# EAGLE design Placa motriz (EAGLE 9.1.3)
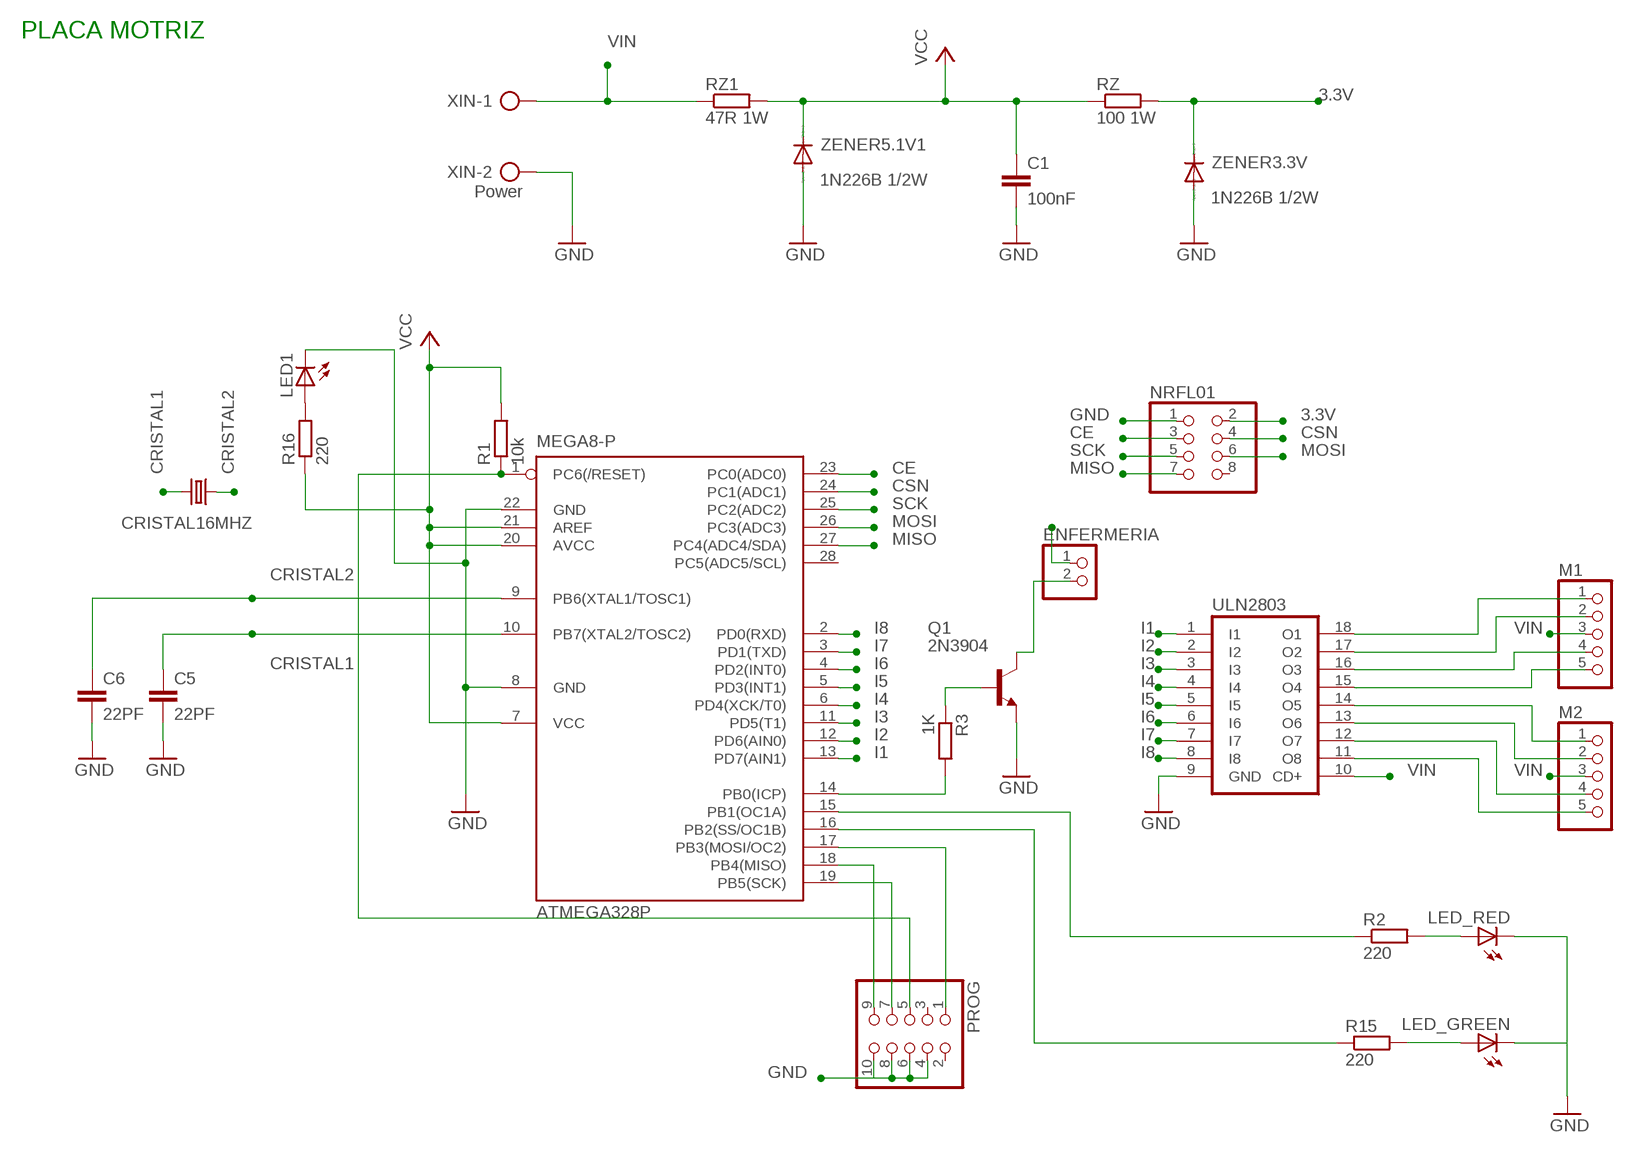
[diagram p0: schematic, sheet 1]

## Parts
ATMEGA328P  MEGA8-P  [DIL28-3]
C1  100nF  C-EU050-024X044  [C050-024X044]
C5  22PF  C-EU050-024X044  [C050-024X044]
C6  22PF  C-EU050-024X044  [C050-024X044]
CRISTAL16MHZ  CRYSTALHC49S  [HC49/S]
ENFERMERIA  PINHD-1X2  [1X02]
LED1  LED5MM  [LED5MM]
LED_GREEN  LED5MM  [LED5MM]
LED_RED  LED5MM  [LED5MM]
M1  PINHD-1X5  [1X05]
M2  PINHD-1X5  [1X05]
NRFL01  PINHD-2X4  [2X04]
PROG  PINHD-2X5  [2X05]
Q1  2N3904  [TO92]
R1  10k  R-EU_0207/15  [0207/15]
R2  220  R-EU_0207/12  [0207/12]
R3  1K  R-EU_0207/10  [0207/10]
R15  220  R-EU_0207/12  [0207/12]
R16  220  R-EU_0207/12  [0207/12]
RZ  100 1W  R-EU_0207/15  [0207/15]
RZ1  47R 1W  R-EU_0207/15  [0207/15]
ULN2803  ULN2803A  [DIL18]
XIN  Power  AK500/2  [AK500/2]
ZENER3.3V  1N226B 1/2W  1N4148DO35-10  [DO35-10]
ZENER5.1V1  1N226B 1/2W  1N4148DO35-10  [DO35-10]

## Nets
3.3V: NRFL01.2 RZ.2 ZENER3.3V.C
CE: ATMEGA328P.23(PC0(ADC0)) NRFL01.3
CRISTAL1: ATMEGA328P.10(PB7(XTAL2/TOSC2)) C5.1 CRISTAL16MHZ.2
CRISTAL2: ATMEGA328P.9(PB6(XTAL1/TOSC1)) C6.1 CRISTAL16MHZ.1
CSN: ATMEGA328P.24(PC1(ADC1)) NRFL01.4
GND: ATMEGA328P.8(GND) ATMEGA328P.22(GND) C1.2 C5.2 C6.2 LED1.K(C) LED_GREEN.K(C) LED_RED.K(C) NRFL01.1 PROG.4 PROG.6 PROG.8 PROG.10 Q1.3(E) ULN2803.9(GND) XIN.2 ZENER3.3V.A ZENER5.1V1.A
I1: ATMEGA328P.13(PD7(AIN1)) ULN2803.1(I1)
I2: ATMEGA328P.12(PD6(AIN0)) ULN2803.2(I2)
I3: ATMEGA328P.11(PD5(T1)) ULN2803.3(I3)
I4: ATMEGA328P.6(PD4(XCK/T0)) ULN2803.4(I4)
I5: ATMEGA328P.5(PD3(INT1)) ULN2803.5(I5)
I6: ATMEGA328P.4(PD2(INT0)) ULN2803.6(I6)
I7: ATMEGA328P.3(PD1(TXD)) ULN2803.7(I7)
I8: ATMEGA328P.2(PD0(RXD)) ULN2803.8(I8)
MISO: ATMEGA328P.27(PC4(ADC4/SDA)) NRFL01.7
MOSI: ATMEGA328P.26(PC3(ADC3)) NRFL01.6
N$1: ATMEGA328P.1(PC6(/RESET)) PROG.5 R1.1
N$2: LED_RED.A R2.2
N$11: M1.1 ULN2803.18(O1)
N$12: M1.2 ULN2803.17(O2)
N$13: M1.4 ULN2803.16(O3)
N$14: M1.5 ULN2803.15(O4)
N$15: M2.1 ULN2803.14(O5)
N$16: ATMEGA328P.17(PB3(MOSI/OC2)) PROG.1
N$17: LED1.A R16.2
N$18: ATMEGA328P.19(PB5(SCK)) PROG.7
N$19: ATMEGA328P.18(PB4(MISO)) PROG.9
N$20: M2.2 ULN2803.13(O6)
N$21: M2.4 ULN2803.12(O7)
N$22: M2.5 ULN2803.11(O8)
N$23: ATMEGA328P.15(PB1(OC1A)) R2.1
N$24: ATMEGA328P.16(PB2(SS/OC1B)) R15.1
N$48: ATMEGA328P.14(PB0(ICP)) R3.2
N$49: Q1.2(B) R3.1
N$50: ENFERMERIA.2 Q1.1(C)
N$153: LED_GREEN.A R15.2
SCK: ATMEGA328P.25(PC2(ADC2)) NRFL01.5
VCC: ATMEGA328P.7(VCC) ATMEGA328P.20(AVCC) ATMEGA328P.21(AREF) C1.1 R1.2 R16.1 RZ1.2 RZ.1 ZENER5.1V1.C
VIN: ENFERMERIA.1 M1.3 M2.3 RZ1.1 ULN2803.10(CD+) XIN.1
Unconnected: ATMEGA328P.28(PC5(ADC5/SCL)) NRFL01.8 PROG.2 PROG.3

## Notes on the sheet
- PLACA MOTRIZ

## Library data of the parts
ATMEGA328P = atmel:MEGA8-P: MICROCONTROLLER 8 Kbytes FLASH, 1 kbytes SRAM, 512 bytes EEPROM, USART, 4-channel 10 bit ADC, 2-channel 8 bit ADC Pin compatible with Atmega48, ATMega88, ATMega168 Source: avr.lbr; OC_FARNELL: unknown; OC_NEWARK: unknown
C1 C5 C6 = rcl:C-EU: CAPACITOR, European symbol
CRISTAL16MHZ = crystal:CRYSTAL: CRYSTAL; OC_FARNELL: 1667008; OC_NEWARK: unknown
ENFERMERIA = pinhead:PINHD-1X2: PIN HEADER
LED1 LED_GREEN LED_RED = led:LED: LED OSRAM: - CHIPLED LG R971, LG N971, LY N971, LG Q971, LY Q971, LO R971, LY R971 LH N974, LH R974 LS Q976, LO Q976, LY Q976 LO Q996 - Hyper CHIPLED LW Q18S LB Q993, LB Q99A, LB R99A - SideLED LS A670, LO A670, LY A670, LG A670, LP A670 LB A673, LV A673, LT A673, LW A673 LH A674 LY A675 LS A676, LA A676, LO A676, LY A676, LW A676 LS A679, LY A679, LG A679 - Hyper Micro SIDELED® LS Y876, LA Y876, LO Y876, LY Y876 LT Y87S - SmartLED LW L88C, LW L88S LB L89C, LB L89S, LG L890 LS L89K, LO L89K, LY L89K LS L896, LA L896, LO L896, LY L896 - TOPLED LS T670, LO T670, LY T670, LG T670, LP T670 LSG T670, LSP T670, LSY T670, LOP T670, LYG T670 LG T671, LOG T671, LSG T671 LB T673, LV T673, LT T673, LW T673 LH T674 LS T676, LA T676, LO T676, LY T676, LB T676, LH T676, LSB T676, LW T676 LB T67C, LV T67C, LT T67C, LS T67K, LO T67K, LY T67K, LW E67C LS E67B, LA E67B, LO E67B, LY E67B, LB E67C, LV E67C, LT E67C LW T67C LS T679, LY T679, LG T679 LS T770, LO T770, LY T770, LG T770, LP T770 LB T773, LV T773, LT T773, LW T773 LH T774 LS E675, LA E675, LY E675, LS T675 LS T776, LA T776, LO T776, LY T776, LB T776 LHGB T686 LT T68C, LB T68C - Hyper Mini TOPLED® LB M676 - Mini TOPLED Santana® LG M470 LS M47K, LO M47K, LY M47K Source: http://www.osram.convergy.de LUXEON: - LUMILED® LXK2-PW12-R00, LXK2-PW12-S00, LXK2-PW14-U00, LXK2-PW14-V00 LXK2-PM12-R00, LXK2-PM12-S00, LXK2-PM14-U00 LXK2-PE12-Q00, LXK2-PE12-R00, LXK2-PE12-S00, LXK2-PE14-T00, LXK2-PE14-U00 LXK2-PB12-K00, LXK2-PB12-L00, LXK2-PB12-M00, LXK2-PB14-N00, LXK2-PB14-P00, LXK2-PB14-Q00 LXK2-PR12-L00, LXK2-PR12-M00, LXK2-PR14-Q00, LXK2-PR14-R00 LXK2-PD12-Q00, LXK2-PD12-R00, LXK2-PD12-S00 LXK2-PH12-R00, LXK2-PH12-S00 LXK2-PL12-P00, LXK2-PL12-Q00, LXK2-PL12-R00 Source: www.luxeon.com KINGBRIGHT: KA-3528ASYC Source: www.kingbright.com
M1 M2 = pinhead:PINHD-1X5: PIN HEADER
NRFL01 = pinhead:PINHD-2X4: PIN HEADER
PROG = pinhead:PINHD-2X5: PIN HEADER
Q1 = transistor-npn:2N3904: NPN Transistor
R1-R3 R15 R16 RZ RZ1 = rcl:R-EU_: RESISTOR, European symbol
ULN2803 = uln-udn:ULN2803A: DRIVER ARRAY
XIN = con-ptr500:AK500/2: CONNECTOR; OC_FARNELL: unknown; OC_NEWARK: unknown
ZENER3.3V ZENER5.1V1 = diode:1N4148: DIODE high speed (Philips)

## Board
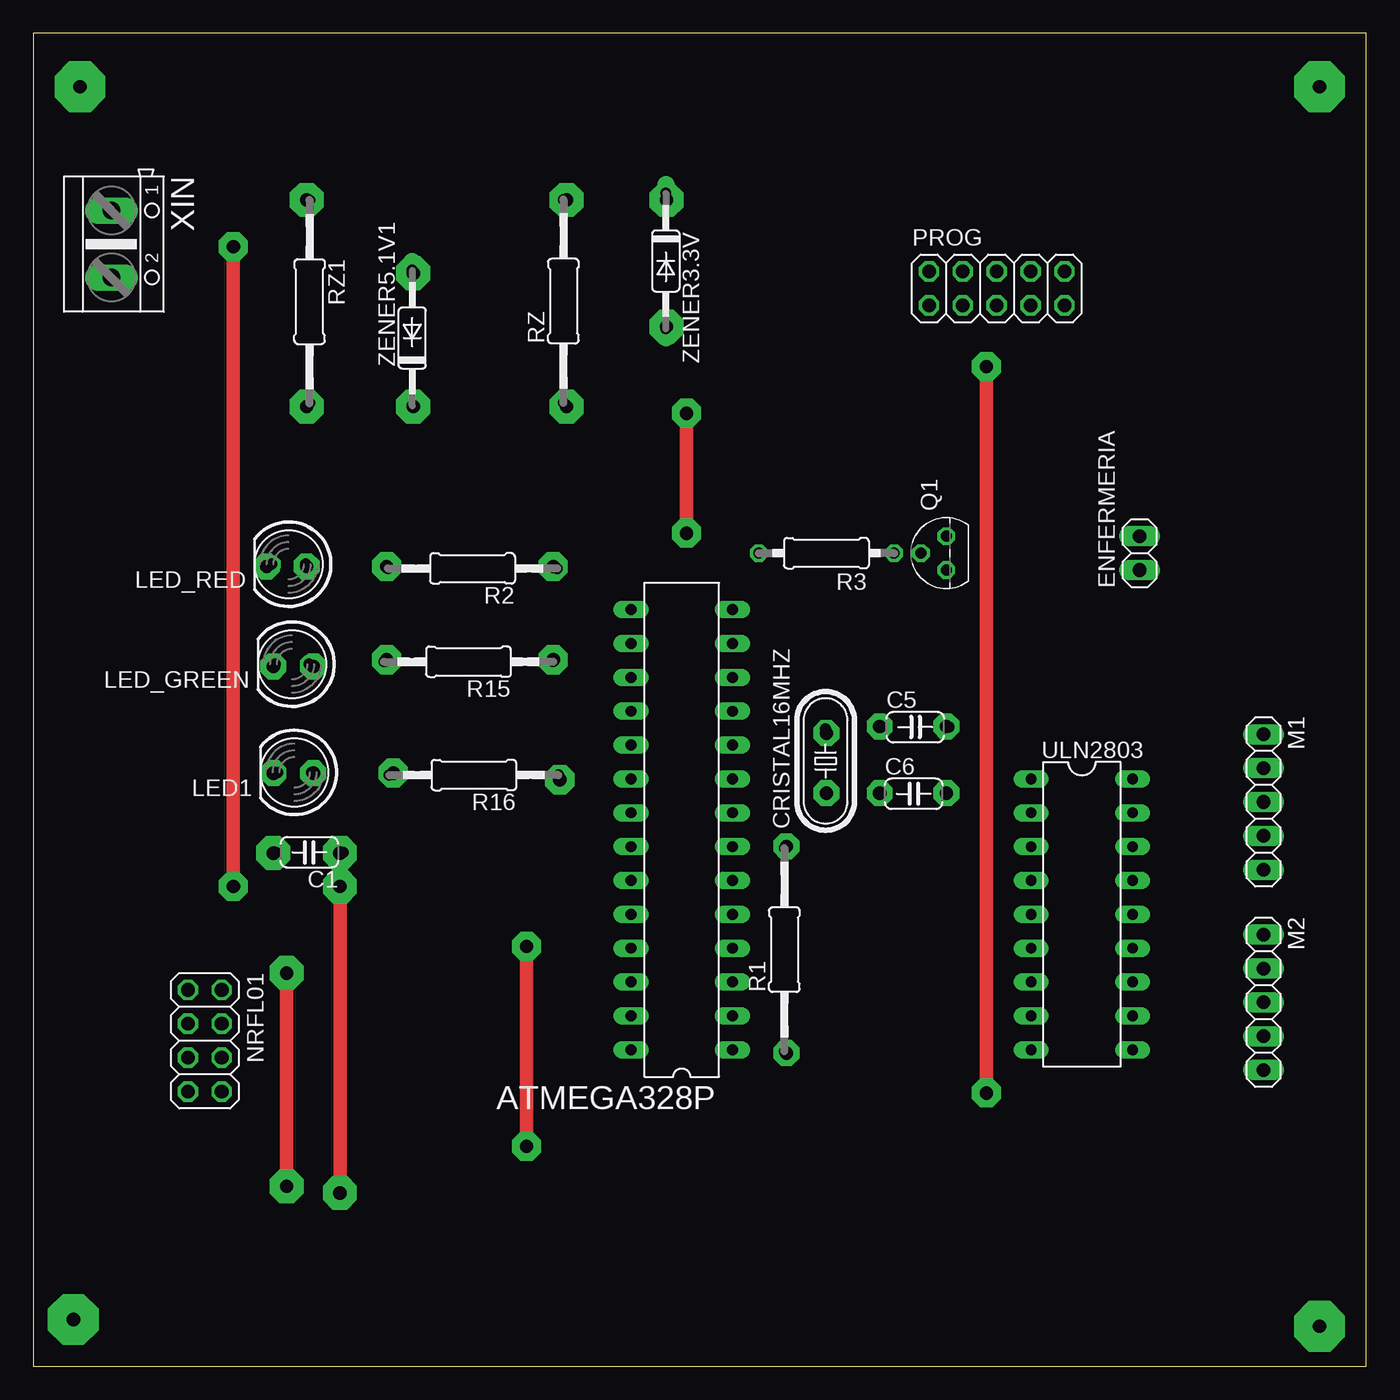
[diagram p1: board, top side]
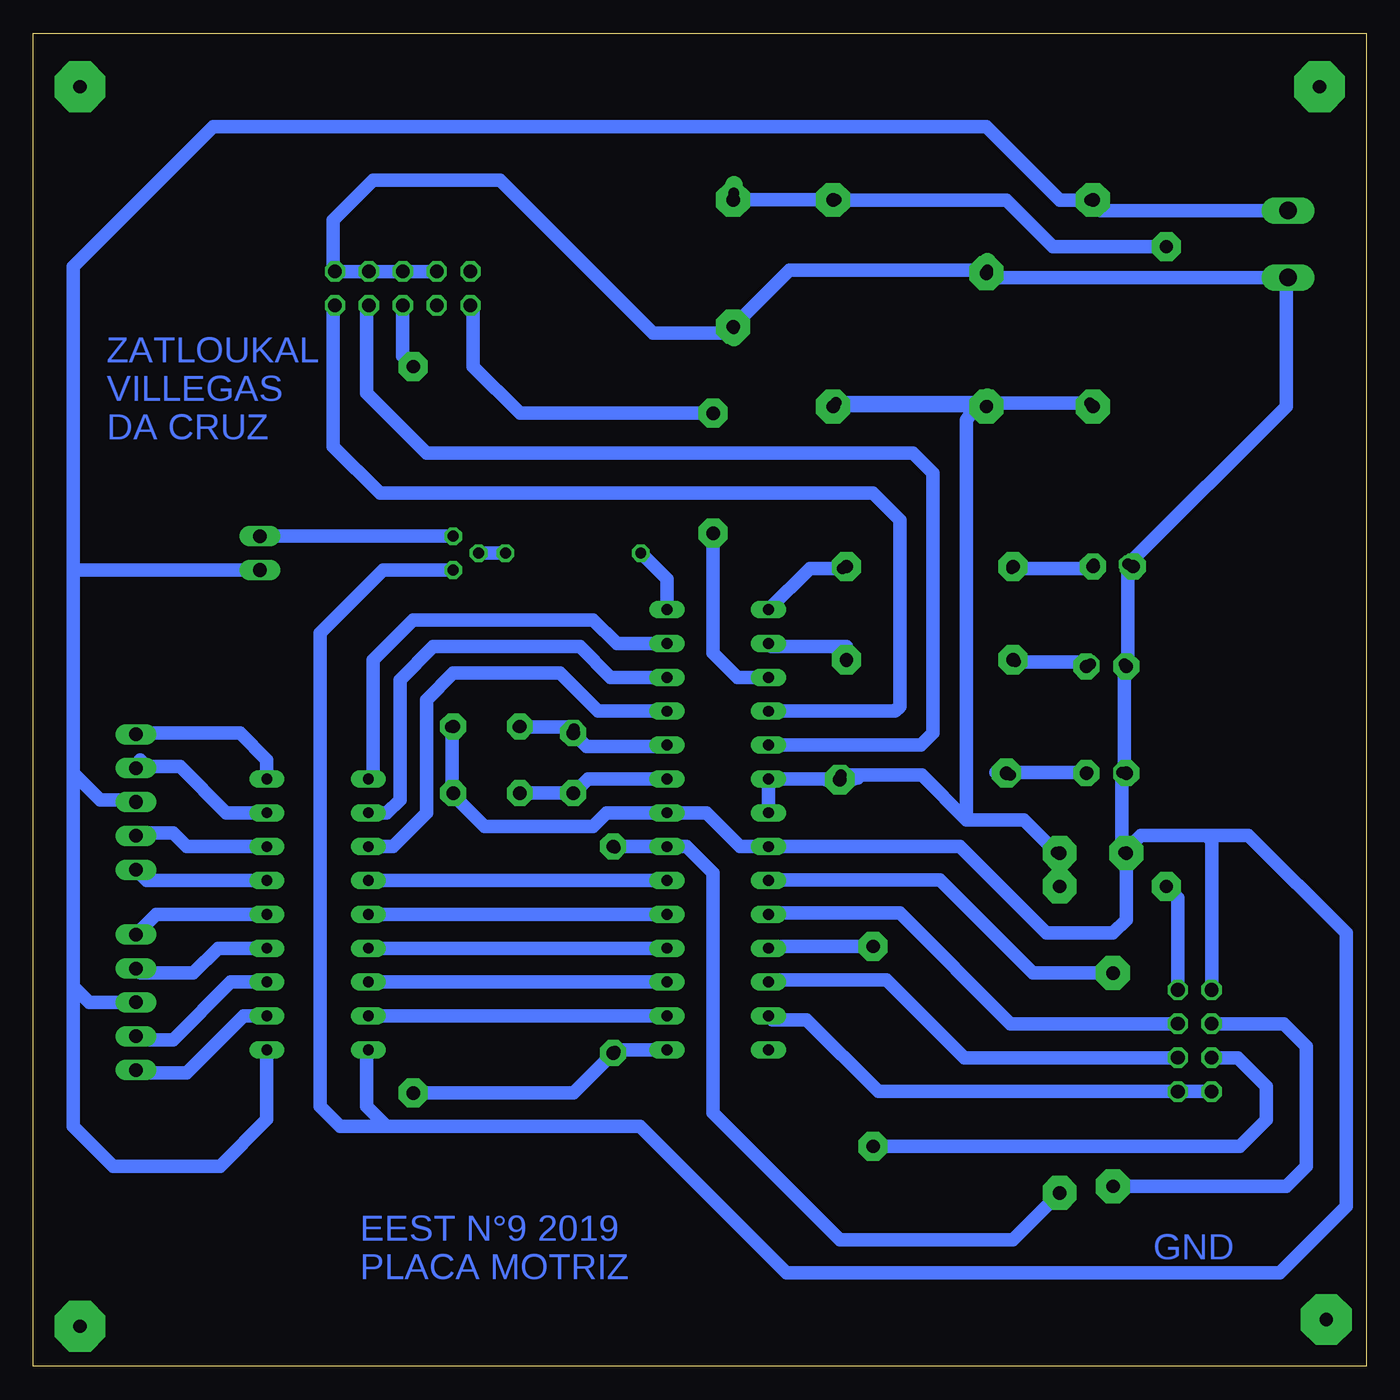
[diagram p2: board, bottom side, seen from below]

Size 100 x 100 mm. Coordinates in mm from the lower left corner, seen from the top.
Outline: 0,0 100,0 100,100 0,100 0,0
Copper layers (1*16): Top 0.035mm / dielectric 1.5mm / Bottom 0.035mm
Design rules "default": minimum track width 10mil, minimum drill 24mil, track to track 8mil, track to pad 8mil, pad to pad 8mil, via to via 8mil, smd to smd 8mil, copper to edge 40mil, drill to drill 8mil, minimum pad ring 10mil, minimum via ring 8mil, stop-mask expansion 4mil, vias tented up to drill 0mil, thermal gap 10mil

### Footprints (pad centres in the part's own frame; a part is rotated, then mirrored left to right if it is on the bottom)
DIL28-3 = drill 0.813 long: 1 -16.51,-3.81; 2 -13.97,-3.81; 3 -11.43,-3.81; 4 -8.89,-3.81; 5 -6.35,-3.81; 6 -3.81,-3.81; 7 -1.27,-3.81; 8 1.27,-3.81; 9 3.81,-3.81; 10 6.35,-3.81; 11 8.89,-3.81; 12 11.43,-3.81; 13 13.97,-3.81; 14 16.51,-3.81; 15 16.51,3.81; 16 13.97,3.81; 17 11.43,3.81; 18 8.89,3.81; 19 6.35,3.81; 20 3.81,3.81; 21 1.27,3.81; 22 -1.27,3.81; 23 -3.81,3.81; 24 -6.35,3.81; 25 -8.89,3.81; 26 -11.43,3.81; 27 -13.97,3.81; 28 -16.51,3.81
C050-024X044 = drill 0.813 octagon: 1 -2.54,0; 2 2.54,0
HC49/S = drill 0.813: 1 -2.413,0; 2 2.413,0
1X02 = drill 1.016 long: 1 -1.27,0; 2 1.27,0
LED5MM = drill 0.813 octagon: A -1.27,0; K 1.27,0
1X05 = drill 1.016 long: 1 -5.08,0; 2 -2.54,0; 3 0,0; 4 2.54,0; 5 5.08,0
2X04 = drill 1.016 octagon: 1 -3.81,-1.27; 2 -3.81,1.27; 3 -1.27,-1.27; 4 -1.27,1.27; 5 1.27,-1.27; 6 1.27,1.27; 7 3.81,-1.27; 8 3.81,1.27
2X05 = drill 1.016 octagon: 1 -5.08,-1.27; 2 -5.08,1.27; 3 -2.54,-1.27; 4 -2.54,1.27; 5 0,-1.27; 6 0,1.27; 7 2.54,-1.27; 8 2.54,1.27; 9 5.08,-1.27; 10 5.08,1.27
TO92 = drill 0.813 octagon: 1 1.27,0; 2 0,1.905; 3 -1.27,0
0207/15 = drill 0.813 octagon: 1 -7.62,0; 2 7.62,0
0207/12 = drill 0.813 octagon: 1 -6.35,0; 2 6.35,0
0207/10 = drill 0.813 octagon: 1 -5.08,0; 2 5.08,0
DIL18 = drill 0.813 long: 1 -10.16,-3.81; 2 -7.62,-3.81; 3 -5.08,-3.81; 4 -2.54,-3.81; 5 0,-3.81; 6 2.54,-3.81; 7 5.08,-3.81; 8 7.62,-3.81; 9 10.16,-3.81; 10 10.16,3.81; 11 7.62,3.81; 12 5.08,3.81; 13 2.54,3.81; 14 0,3.81; 15 -2.54,3.81; 16 -5.08,3.81; 17 -7.62,3.81; 18 -10.16,3.81
AK500/2 = drill 1.321 long: 1 -2.515,0; 2 2.515,0
DO35-10 = drill 0.813 long: A 5.08,0; C -5.08,0

### Placement (x,y rotation side)
ATMEGA328P  48.65,40.25 90 top
C1  20.71,38.55 180 top
C5  66.17,47.95 0 top
C6  66.05,42.95 0 top
CRISTAL16MHZ  59.44,45.41 90 top
ENFERMERIA  83,61 90 top
LED1  19.59,44.55 180 top
LED_GREEN  19.41,52.67 180 top
LED_RED  19.15,60.17 180 top
M1  92.3,42.33 270 top
M2  92.3,27.3 270 top
NRFL01  12.86,24.42 270 top
PROG  72.28,80.86 0 top
Q1  68.5,61 90 top
R1  56.35,31.25 90 top
R2  32.95,59.85 180 top
R3  59.5,61 180 top
R15  32.65,52.85 180 top
R16  33.05,44.35 180 top
RZ  39.77,79.91 90 top
RZ1  20.73,79.87 270 top
ULN2803  78.67,33.9 270 top
XIN  5.85,84.19 270 top
ZENER3.3V  47.45,82.92 270 top
ZENER5.1V1  28.43,77.14 90 top

### Tracks (layer width: path | path; a pad name or v marks a point on that pad's centre or on a via)
3.3V  (via drill 1 pad 2.18)
  Top 1.016: v15,36 v15,84
  Bottom 1.016: ZENER3.3V.C 46.98,87.53 RZ.2 39.74,87.5 27,87.5 23.5,84 v15,84 | NRFL01.2 14.13,35.13 v15,36
CE  (via drill 1 pad 2.54)
  Top 1.016: v19,13.5 v19,29.5
  Bottom 1.016: NRFL01.3 6.19,25.69 4.5,24 4.5,15 6,13.5 v19,13.5 | v19,29.5 25,29.5 32,36.5 44.78,36.5 ATMEGA328P.23
CRISTAL1
  Bottom 1.016: C5.1 59.57,47.95 CRISTAL16MHZ.2 59.44,47.44 58.5,46.5 52.56,46.5 ATMEGA328P.10
CRISTAL2
  Bottom 1.016: ATMEGA328P.9 58.38,44.06 CRISTAL16MHZ.1 63.46,43 C6.1
CSN
  Bottom 1.016: NRFL01.4 26.69,25.69 35,34 44.74,34 ATMEGA328P.24
GND  (via drill 1 pad 2.54)
  Bottom 1.016: 12,39.83 8.83,39.83 1.5,32.5 1.5,12 6.5,7 43.5,7 54.5,18 73.5,18 | ATMEGA328P.22 46.98,38.98 47,39 | 52.44,41.5 49.5,41.5 47,39 | 52.44,41.5 ATMEGA328P.8 56.98,41.52 57,41.5 | C5.2 68.59,47.83 C6.2 66.14,40.5 58,40.5 57,41.5 | 48,77.5 v47.5,78 43.28,82.22 ZENER5.1V1.A 27.89,81.67 XIN.2 6,81.53 6,72 17.83,60.17 LED_RED.K 17.88,52.93 LED_GREEN.K 18.14,44.73 LED1.K 18.32,38.7 C1.2 | 48,77.5 47.79,77.5 ZENER3.3V.A | PROG.4 PROG.6 PROG.8 PROG.10 77.5,82.27 77.5,86 74.5,89 65,89 53.5,77.5 48,77.5 | NRFL01.1 11.59,39.42 12,39.83 | 73.5,18 75,19.5 75,23.6 ULN2803.9 | 12,39.83 16.89,39.83 C1.2 | 57,41.5 52.44,41.5 | 47,39 30.5,39 24,32.5 19,32.5 18,33.5 18,38.38 C1.2 | Q1.3 73.77,59.73 78.5,55 78.5,19.5 77,18 73.5,18
I1
  Bottom 1.016: ATMEGA328P.13 56.22,54.22 58,56 71.5,56 74.5,53 74.5,44.42 ULN2803.1
I2
  Bottom 1.016: ATMEGA328P.12 56.68,51.68 59,54 70,54 72.5,51.5 72.5,42.5 73.5,41.5 74.84,41.5 ULN2803.2
I3
  Bottom 1.016: ATMEGA328P.11 57.64,49.14 60.5,52 68.5,52 70.5,50 70.5,41.5 73,39 74.84,39 ULN2803.3
I4
  Bottom 1.016: ULN2803.4 ATMEGA328P.6
I5
  Bottom 1.016: ATMEGA328P.5 ULN2803.5
I6
  Bottom 1.016: ULN2803.6 ATMEGA328P.4
I7
  Bottom 1.016: ATMEGA328P.3 ULN2803.7
I8
  Bottom 1.016: ULN2803.8 ATMEGA328P.2
MISO
  Bottom 1.016: NRFL01.7 36.61,20.61 42,26 44.56,26 ATMEGA328P.27
MOSI
  Bottom 1.016: NRFL01.6 30.15,23.15 36,29 44.66,29 ATMEGA328P.26
N$1  (via drill 1 pad 2.18)
  Top 1.016: v71.5,75 v71.5,20.5
  Bottom 1.016: ATMEGA328P.1 56.24,23.74 R1.1 59.48,20.5 v71.5,20.5 | PROG.5 72.28,75.78 v71.5,75
N$2
  Bottom 1.016: R2.2 20.74,59.85 LED_RED.A
N$3  (via drill 1 pad 2.18)
  other vias: 27,44.5
N$4  (via drill 1 pad 2.18)
  other vias: 26.5,53
N$5  (via drill 1 pad 2.18)
  other vias: 26.5,60
N$6  (via drill 1 pad 2.18)
  other vias: 39,60
N$7  (via drill 1 pad 2.54)
  other vias: 23,38.5
N$8  (via drill 1 pad 2.54)
  other vias: 18,38.5
N$9  (via drill 1 pad 1.93)
  other vias: 21,44.5
N$10  (via drill 1 pad 1.93)
  other vias: 18,44.5
N$11
  Bottom 1.016: ULN2803.18 82.48,45.48 84.5,47.5 92.21,47.5 M1.1
N$12
  Bottom 1.016: ULN2803.17 85.52,41.52 89,45 91.5,45 92,45.5 92,45.17 M1.2
N$13
  Bottom 1.016: ULN2803.16 88.48,38.98 89.5,40 92.09,40 M1.4
N$14
  Bottom 1.016: ULN2803.15 91.49,36.44 M1.5
N$15
  Bottom 1.016: ULN2803.14 90.78,33.9 M2.1
N$16  (via drill 1 pad 2.18)
  Top 1.016: v49,62.5 v49,71.5
  Bottom 1.016: ATMEGA328P.17 47.18,51.68 49,53.5 v49,62.5 | v49,71.5 63.5,71.5 67,75 67,79.39 PROG.1
N$17
  Bottom 1.016: LED1.A 27.77,44.55 R16.2
N$18
  Bottom 1.016: ATMEGA328P.19 33.4,46.6 32.5,47.5 32.5,67 34,68.5 70.5,68.5 75,73 75,79.41 PROG.7
N$19
  Bottom 1.016: ATMEGA328P.18 35.36,49.14 35,49.5 35,63.5 37,65.5 74,65.5 77.5,69 77.5,79.45 PROG.9
N$20
  Bottom 1.016: ULN2803.13 86.14,31.36 88,29.5 91.96,29.5 M2.2
N$21
  Bottom 1.016: ULN2803.12 85.18,28.82 89.5,24.5 92.04,24.5 M2.4
N$22
  Bottom 1.016: ULN2803.11 84.22,26.28 88.5,22 92.08,22 M2.5
N$23
  Bottom 1.016: R2.1 41.75,59.85 ATMEGA328P.15
N$24  (via drill 1 pad 2.18)
  Bottom 1.016: R15.1 38.85,52.85 v39,53 39,54 44.62,54 ATMEGA328P.16
N$25  (via drill 1 pad 1.93)
  other vias: 18,52.5
N$26  (via drill 1 pad 1.93)
  other vias: 21,52.5
N$27  (via drill 1 pad 1.93)
  other vias: 17.5,60
N$28  (via drill 1 pad 1.93)
  other vias: 20.5,60
N$29  (via drill 1 pad 1.93)
  other vias: 59.5,43
N$30  (via drill 1 pad 1.93)
  other vias: 59.5,47.5
N$31  (via drill 1 pad 1.93)
  other vias: 63.5,48
N$32  (via drill 1 pad 1.93)
  other vias: 63.5,43
N$33  (via drill 1 pad 1.93)
  other vias: 68.5,43
N$34  (via drill 1 pad 1.93)
  other vias: 68.5,48
N$35  (via drill 1 pad 2.54)
  other vias: 40,87.5
N$36  (via drill 1 pad 2.54)
  other vias: 40,72
N$37  (via drill 1 pad 2.54)
  other vias: 20.5,72
N$38  (via drill 1 pad 2.54)
  other vias: 20.5,87.5
N$39  (via drill 1 pad 2.54)
  other vias: 28.5,82
N$40  (via drill 1 pad 2.54)
  other vias: 28.5,72
N$41  (via drill 1 pad 2.54)
  other vias: 47.5,87.5
N$42  (via drill 1 pad 1.93)
  other vias: 56.5,23.5
N$43  (via drill 1 pad 1.93)
  other vias: 56.5,39
N$44  (via drill 1 pad 3.81)
  other vias: 3,3.5
N$45  (via drill 1 pad 3.81)
  other vias: 96.5,3
N$46  (via drill 1 pad 3.81)
  other vias: 96.5,96
N$47  (via drill 1 pad 3.81)
  other vias: 3.5,96
N$48
  Bottom 1.016: ATMEGA328P.14 52.46,59.04 R3.2
N$49
  Bottom 1.016: R3.1 Q1.2
N$50
  Bottom 1.016: Q1.1 ENFERMERIA.2 | ENFERMERIA.2 83.27,62.27 83.5,62.5 83.23,62.5 ENFERMERIA.2
N$153
  Bottom 1.016: R15.2 20.86,52.85 LED_GREEN.A
SCK  (via drill 1 pad 2.18)
  Top 1.016: v37,16.5 v37,31.5
  Bottom 1.016: NRFL01.5 9.65,23.15 7.5,21 7.5,18.5 9.5,16.5 v37,16.5 | v37,31.5 44.7,31.5 ATMEGA328P.25
VCC  (via drill 1 pad 2.18, 1 pad 2.54)
  Top 1.016: v23,13 v23,36
  Bottom 1.016: RZ1.2 28.24,72.25 ZENER5.1V1.C 39.54,72.06 RZ.1 28.71,72.29 28.5,72.5 29,72.5 30,71 30,41 | R16.1 38.42,44.06 ATMEGA328P.20 ATMEGA328P.21 | R1.2 56.24,38.98 ATMEGA328P.7 50.98,38.98 49,37 49,19 39.5,9.5 26.5,9.5 v23,13 | R16.1 38.13,44.13 v39.5,44 40.5,44 | v23,36 23,38.3 C1.1 25.7,41 30,41 | R16.1 33.35,44.35 30,41
VIN
  Bottom 1.016: XIN.1 19.95,86.7 RZ1.1 22.99,87.49 28.5,93 86.5,93 97,82.5 97,59.5 | 97,59.5 97,44.5 | 97,44.5 95,42.5 92.47,42.5 M1.3 | 97,28.5 97,44.5 | ULN2803.10 82.48,18.52 86,15 94,15 97,18 97,28.5 | M2.3 95.8,27.3 97,28.5 | ENFERMERIA.1 96.77,59.73 97,59.5

### Text on the board
Bottom: ZATLOUKAL / VILLEGAS / DA CRUZ | GND | EEST N°9 2019 / PLACA MOTRIZ